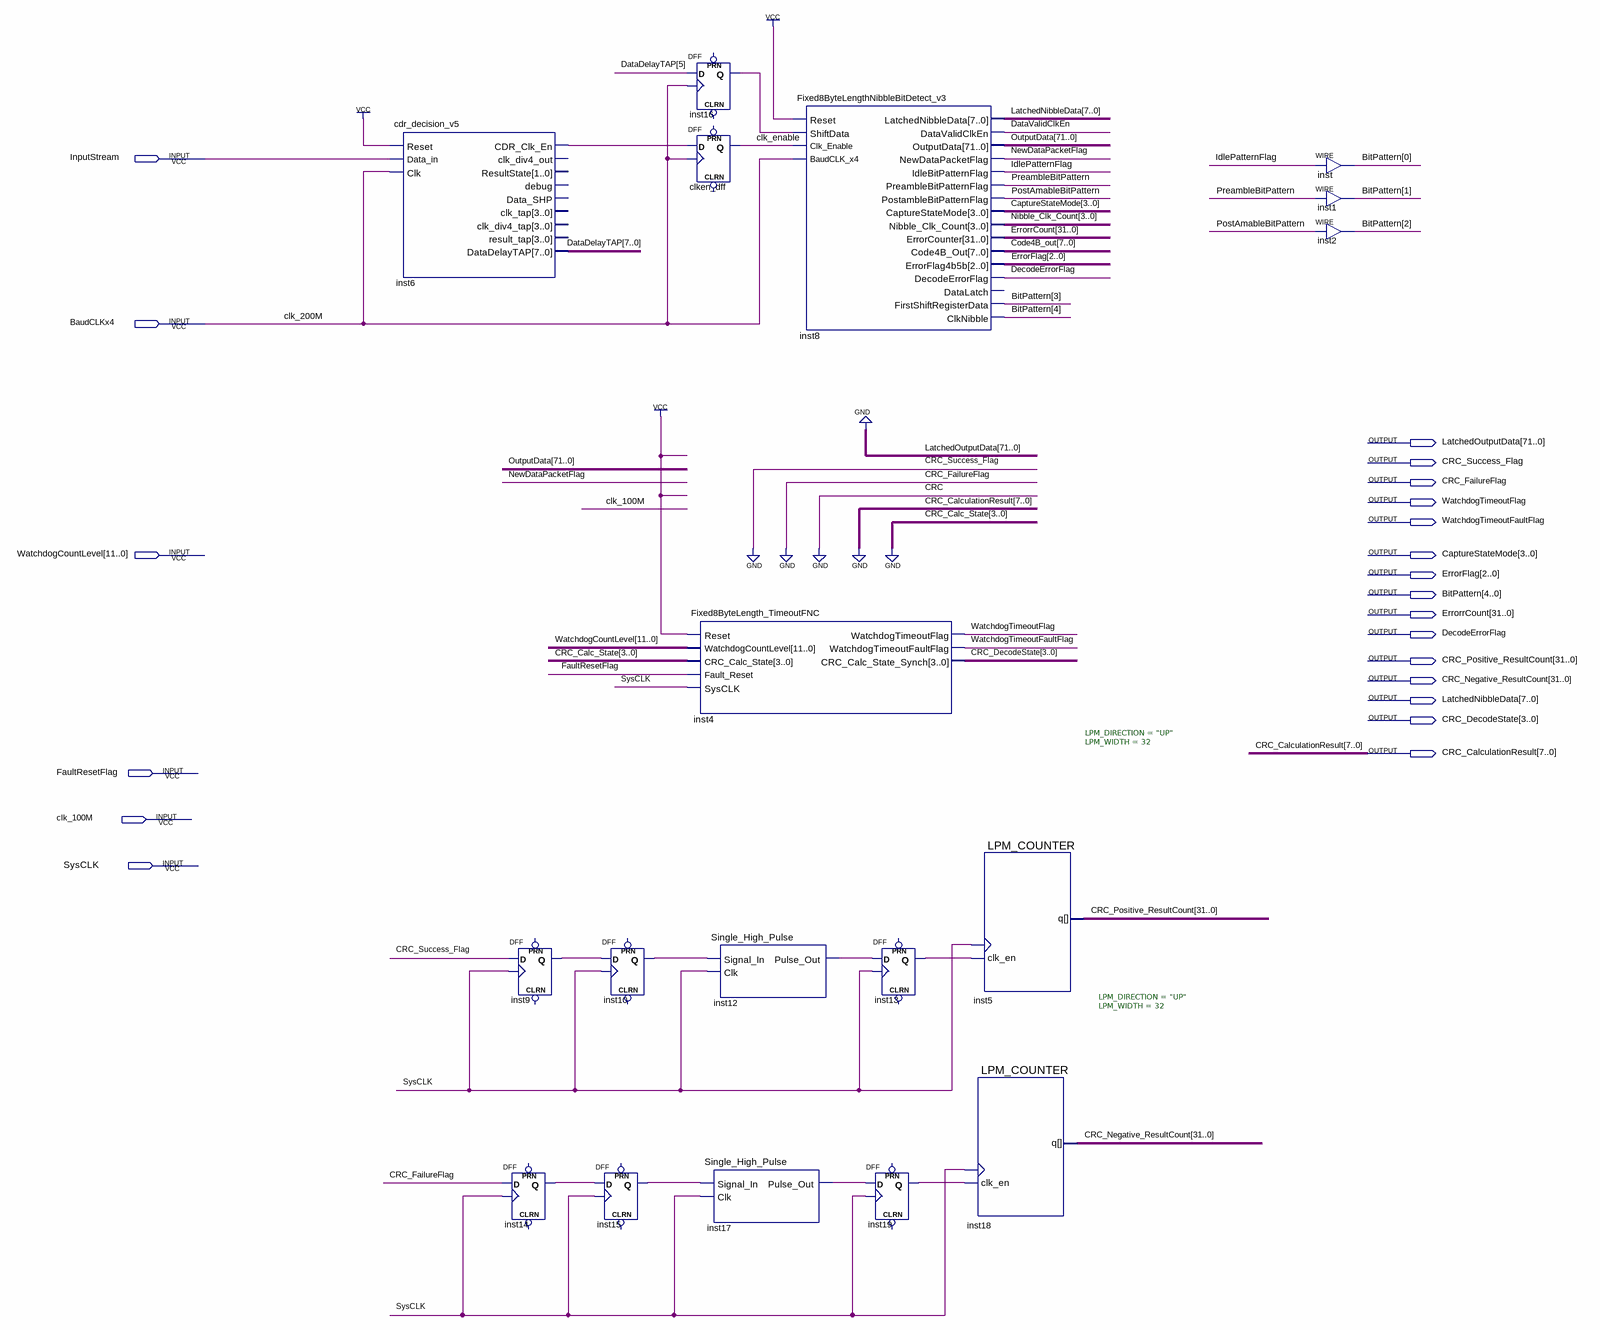
[diagram p0: schematic sheet]
// Quartus schematic NonIniSingleFastLVDS_StreamControllerv1.bdf as structural Verilog: 18 symbols, 21 pins
module NonIniSingleFastLVDS_StreamControllerv1 (
  input  InputStream,
  input  BaudCLKx4,
  input  [11:0] WatchdogCountLevel,
  input  FaultResetFlag,
  input  clk_100M,
  input  SysCLK,
  output [71:0] LatchedOutputData,
  output CRC_Success_Flag,
  output CRC_FailureFlag,
  output WatchdogTimeoutFlag,
  output WatchdogTimeoutFaultFlag,
  output [3:0] CaptureStateMode,
  output [2:0] ErrorFlag,
  output [4:0] BitPattern,
  output [31:0] ErrorrCount,
  output DecodeErrorFlag,
  output [31:0] CRC_Positive_ResultCount,
  output [31:0] CRC_Negative_ResultCount,
  output [7:0] LatchedNibbleData,
  output [3:0] CRC_DecodeState,
  output [7:0] CRC_CalculationResult
);

  wire clk_enable, DataValidClkEn, IdlePatternFlag, inst6_cdr_clk_en, inst9_q, inst10_q, inst12_pulse_out,
       inst13_q, inst14_q, inst15_q, inst16_q, inst17_pulse_out, inst19_q, NewDataPacketFlag,
       PostAmableBitPattern, PreambleBitPattern;
  wire [3:0] Nibble_Clk_Count;
  wire [7:0] Code4B_out, DataDelayTAP;
  wire [71:0] OutputData;

  cdr_decision_v5 inst6 (
    .Reset(1'b1), .Data_in(InputStream), .Clk(BaudCLKx4), .CDR_Clk_En(inst6_cdr_clk_en),
    .DataDelayTAP(DataDelayTAP));  // open: clk_div4_out, ResultState, debug, Data_SHP, clk_tap, clk_div4_tap, result_tap
  DFF inst9 (.CLK(SysCLK), .D(1'b0), .Q(inst9_q));  // open: CLRN, PRN
  DFF inst14 (.CLK(SysCLK), .D(1'b0), .Q(inst14_q));  // open: CLRN, PRN
  DFF inst10 (.CLK(SysCLK), .D(inst9_q), .Q(inst10_q));  // open: CLRN, PRN
  DFF inst15 (.CLK(SysCLK), .D(inst14_q), .Q(inst15_q));  // open: CLRN, PRN
  DFF inst16 (.CLK(BaudCLKx4), .D(DataDelayTAP[5]), .Q(inst16_q));  // open: CLRN, PRN
  DFF clken_dff (.CLK(BaudCLKx4), .D(inst6_cdr_clk_en), .Q(clk_enable));  // open: CLRN, PRN
  Fixed8ByteLength_TimeoutFNC inst4 (
    .Reset(1'b1), .WatchdogCountLevel(WatchdogCountLevel), .CRC_Calc_State(4'b0000),
    .Fault_Reset(FaultResetFlag), .SysCLK(SysCLK), .WatchdogTimeoutFlag(WatchdogTimeoutFlag),
    .WatchdogTimeoutFaultFlag(WatchdogTimeoutFaultFlag), .CRC_Calc_State_Synch(CRC_DecodeState));
  Single_High_Pulse inst12 (.Signal_In(inst10_q), .Clk(SysCLK), .Pulse_Out(inst12_pulse_out));
  Single_High_Pulse inst17 (.Signal_In(inst15_q), .Clk(SysCLK), .Pulse_Out(inst17_pulse_out));
  Fixed8ByteLengthNibbleBitDetect_v3 inst8 (
    .Reset(1'b1), .ShiftData(inst16_q), .Clk_Enable(clk_enable), .BaudCLK_x4(BaudCLKx4),
    .LatchedNibbleData(LatchedNibbleData), .DataValidClkEn(DataValidClkEn), .OutputData(OutputData),
    .NewDataPacketFlag(NewDataPacketFlag), .IdleBitPatternFlag(IdlePatternFlag),
    .PreambleBitPatternFlag(PreambleBitPattern), .PostambleBitPatternFlag(PostAmableBitPattern),
    .CaptureStateMode(CaptureStateMode), .Nibble_Clk_Count(Nibble_Clk_Count), .ErrorCounter(ErrorrCount),
    .Code4B_Out(Code4B_out), .ErrorFlag4b5b(ErrorFlag), .DecodeErrorFlag(DecodeErrorFlag),
    .FirstShiftRegisterData(BitPattern[3]), .ClkNibble(BitPattern[4]));  // open: DataLatch
  DFF inst13 (.CLK(SysCLK), .D(inst12_pulse_out), .Q(inst13_q));  // open: CLRN, PRN
  DFF inst19 (.CLK(SysCLK), .D(inst17_pulse_out), .Q(inst19_q));  // open: CLRN, PRN
  LPM_COUNTER #(.LPM_DIRECTION("UP"), .LPM_WIDTH(32)) inst5 (
    .clk_en(inst13_q), .clock(SysCLK), .q(CRC_Positive_ResultCount));
  LPM_COUNTER #(.LPM_DIRECTION("UP"), .LPM_WIDTH(32)) inst18 (
    .clk_en(inst19_q), .clock(SysCLK), .q(CRC_Negative_ResultCount));
  assign BitPattern[0] = IdlePatternFlag;  // WIRE inst
  assign BitPattern[1] = PreambleBitPattern;  // WIRE inst1
  assign BitPattern[2] = PostAmableBitPattern;  // WIRE inst2

  assign CRC_CalculationResult = {8{1'b0}};
  assign CRC_FailureFlag = 1'b0;
  assign CRC_Success_Flag = 1'b0;
  assign LatchedOutputData = {72{1'b0}};

  // Other names for the same wires on the sheet: clk_200M = BaudCLKx4
endmodule
